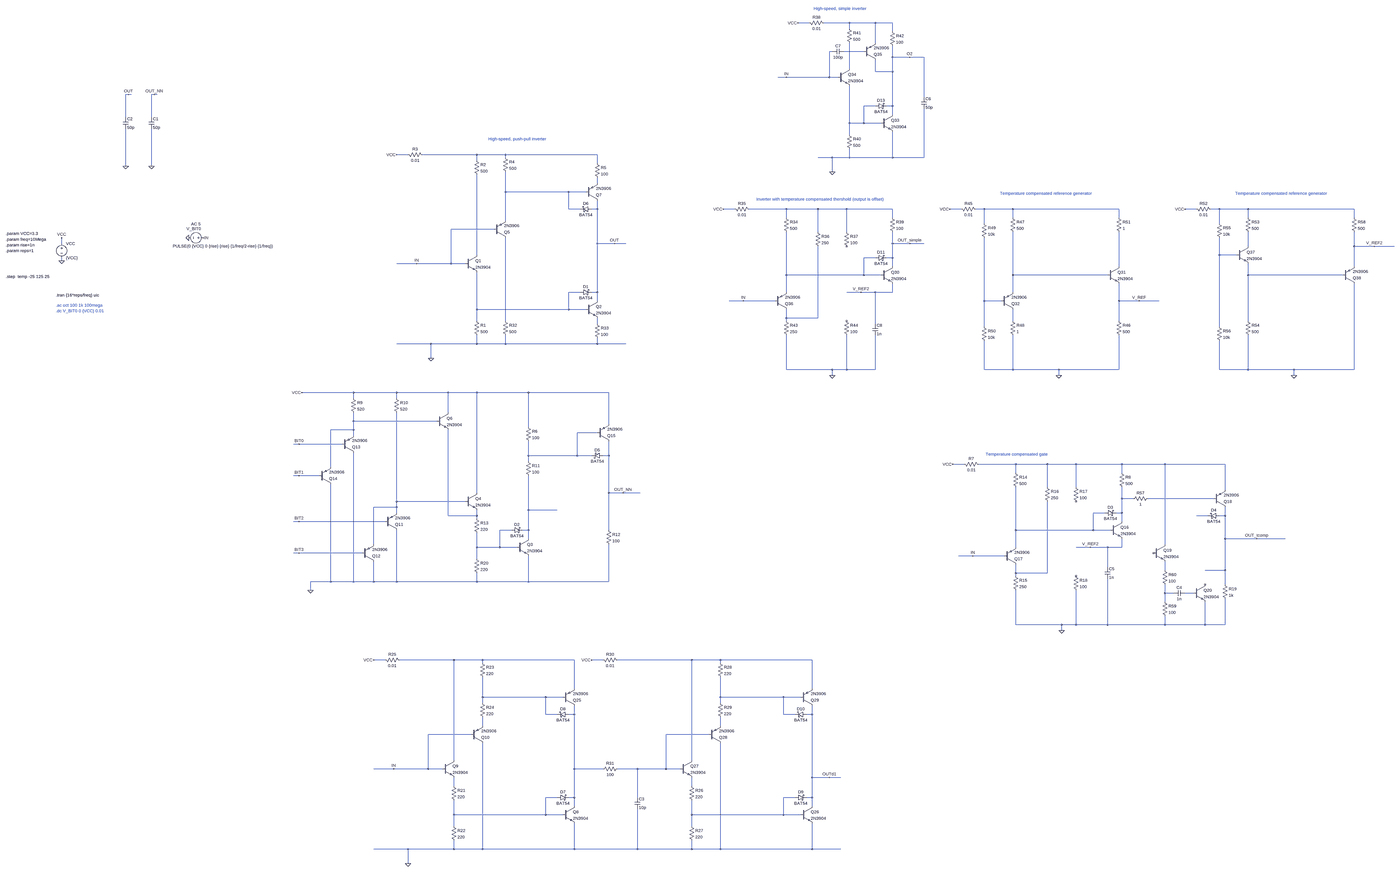
[diagram p0: schematic delay.asc, whole sheet]
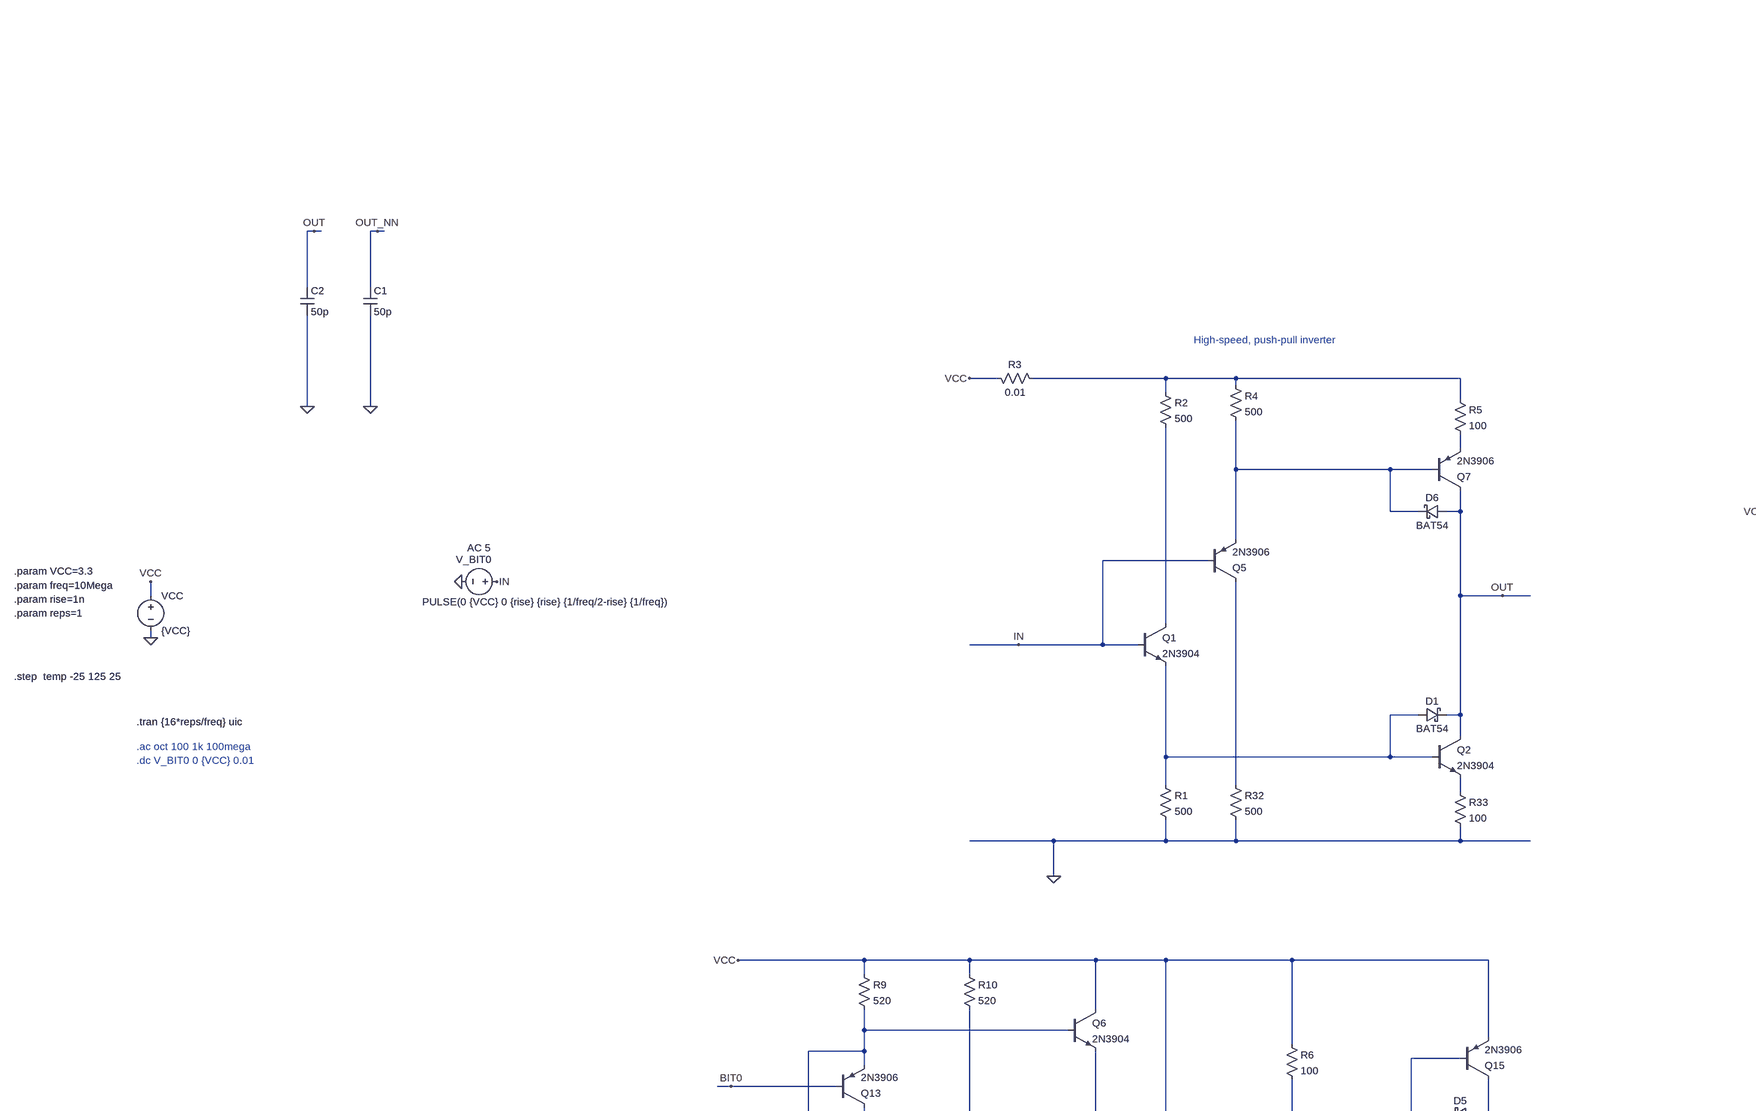
[diagram p1: schematic delay.asc, part, row 1 of 2, column 1 of 2]
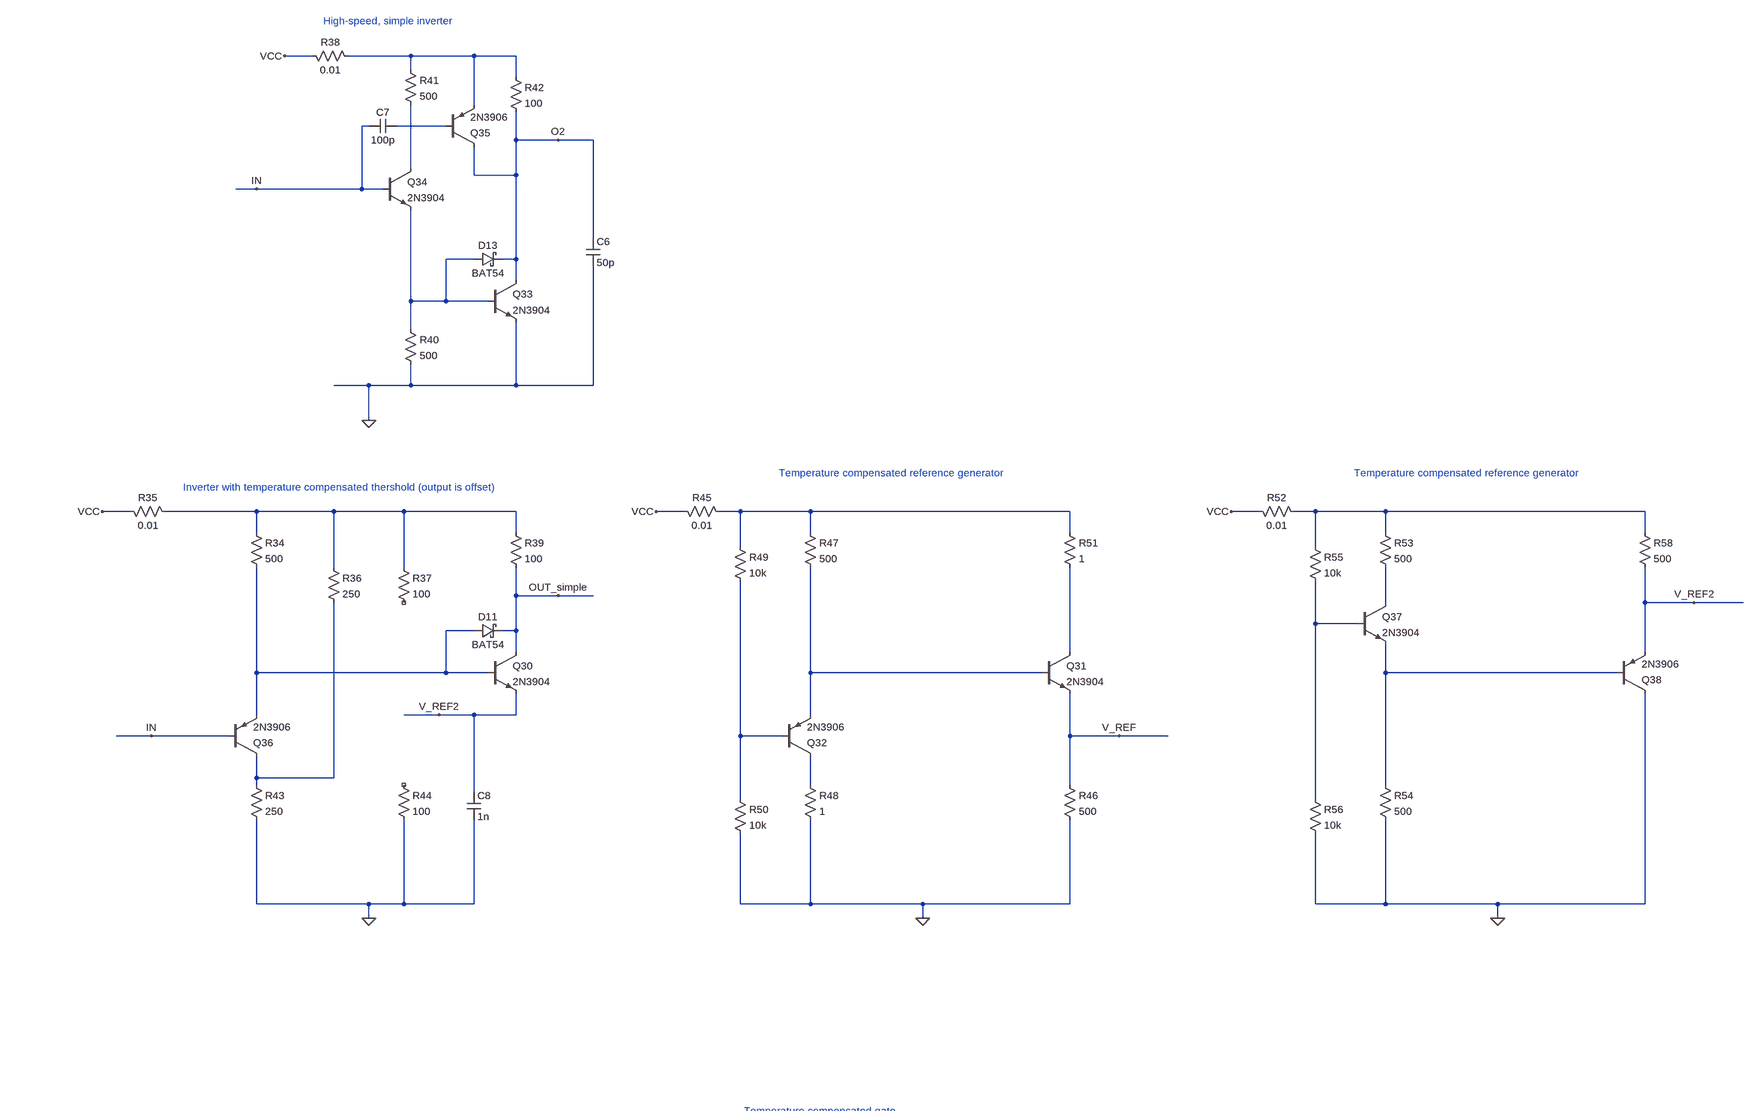
[diagram p2: schematic delay.asc, part, row 1 of 2, column 2 of 2]
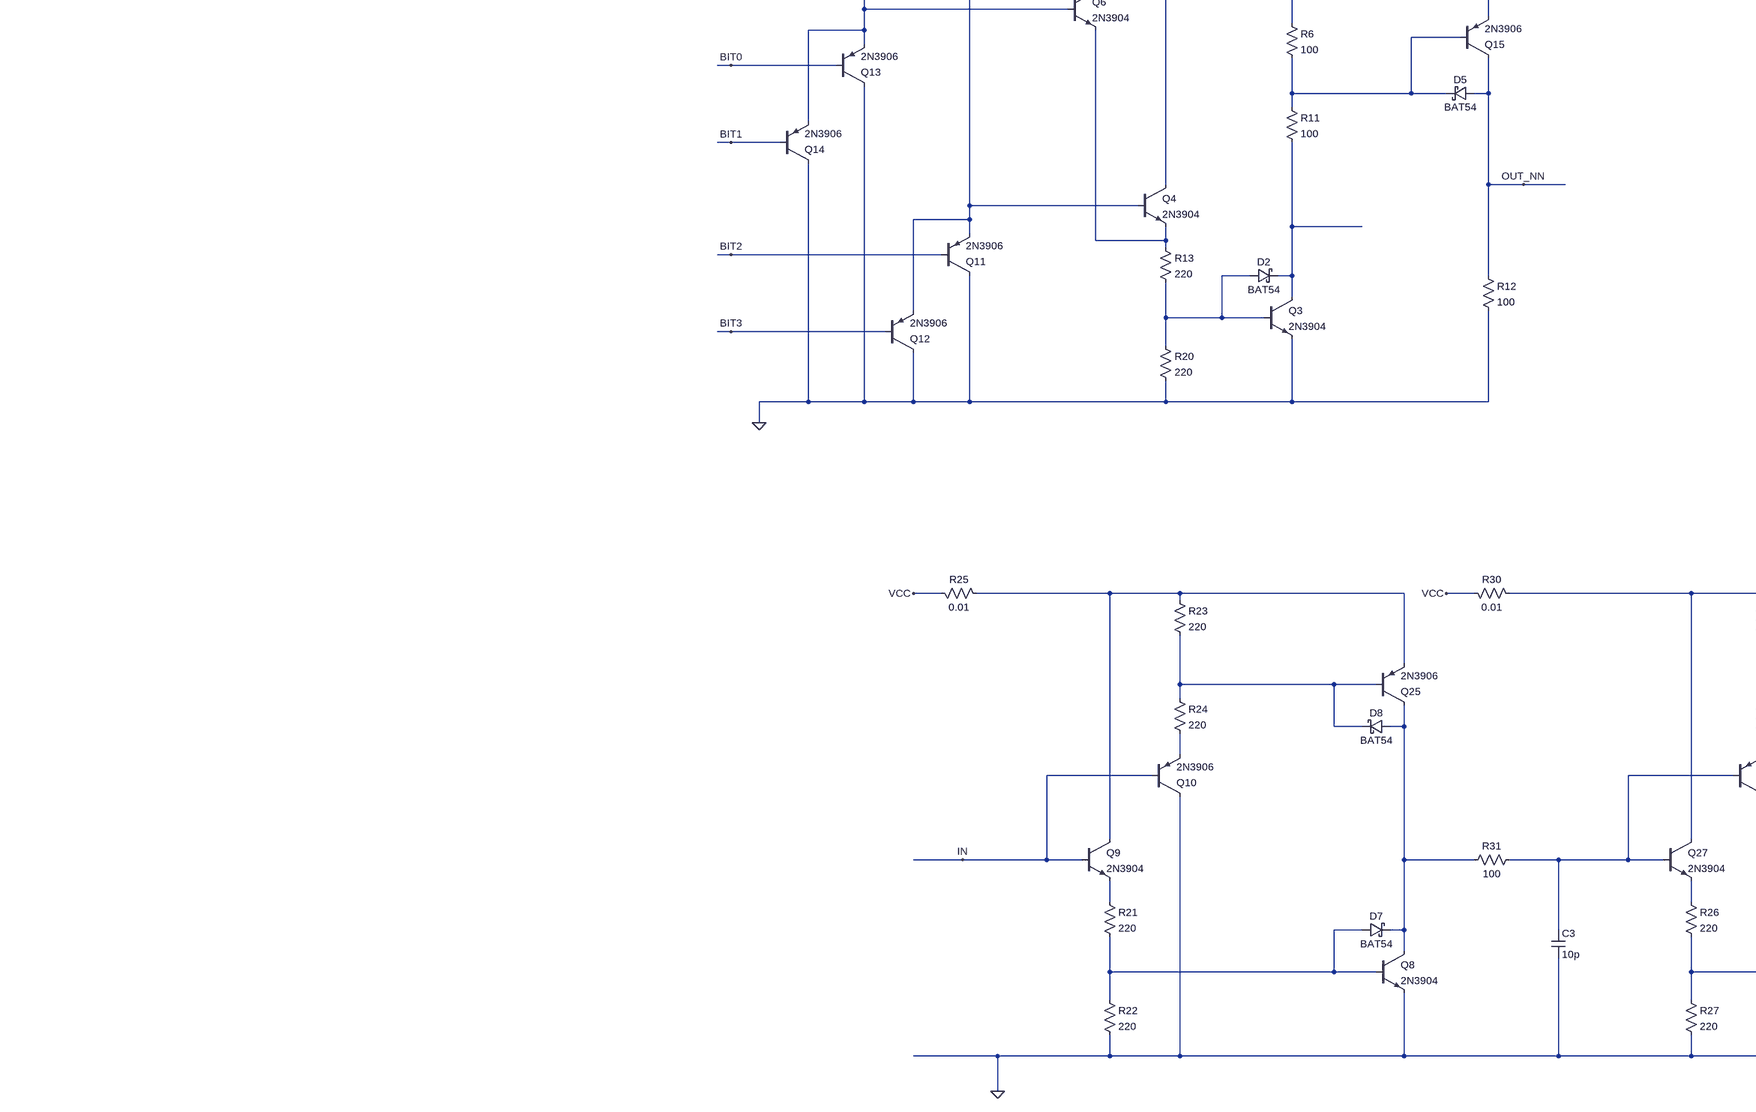
[diagram p3: schematic delay.asc, part, row 2 of 2, column 1 of 2]
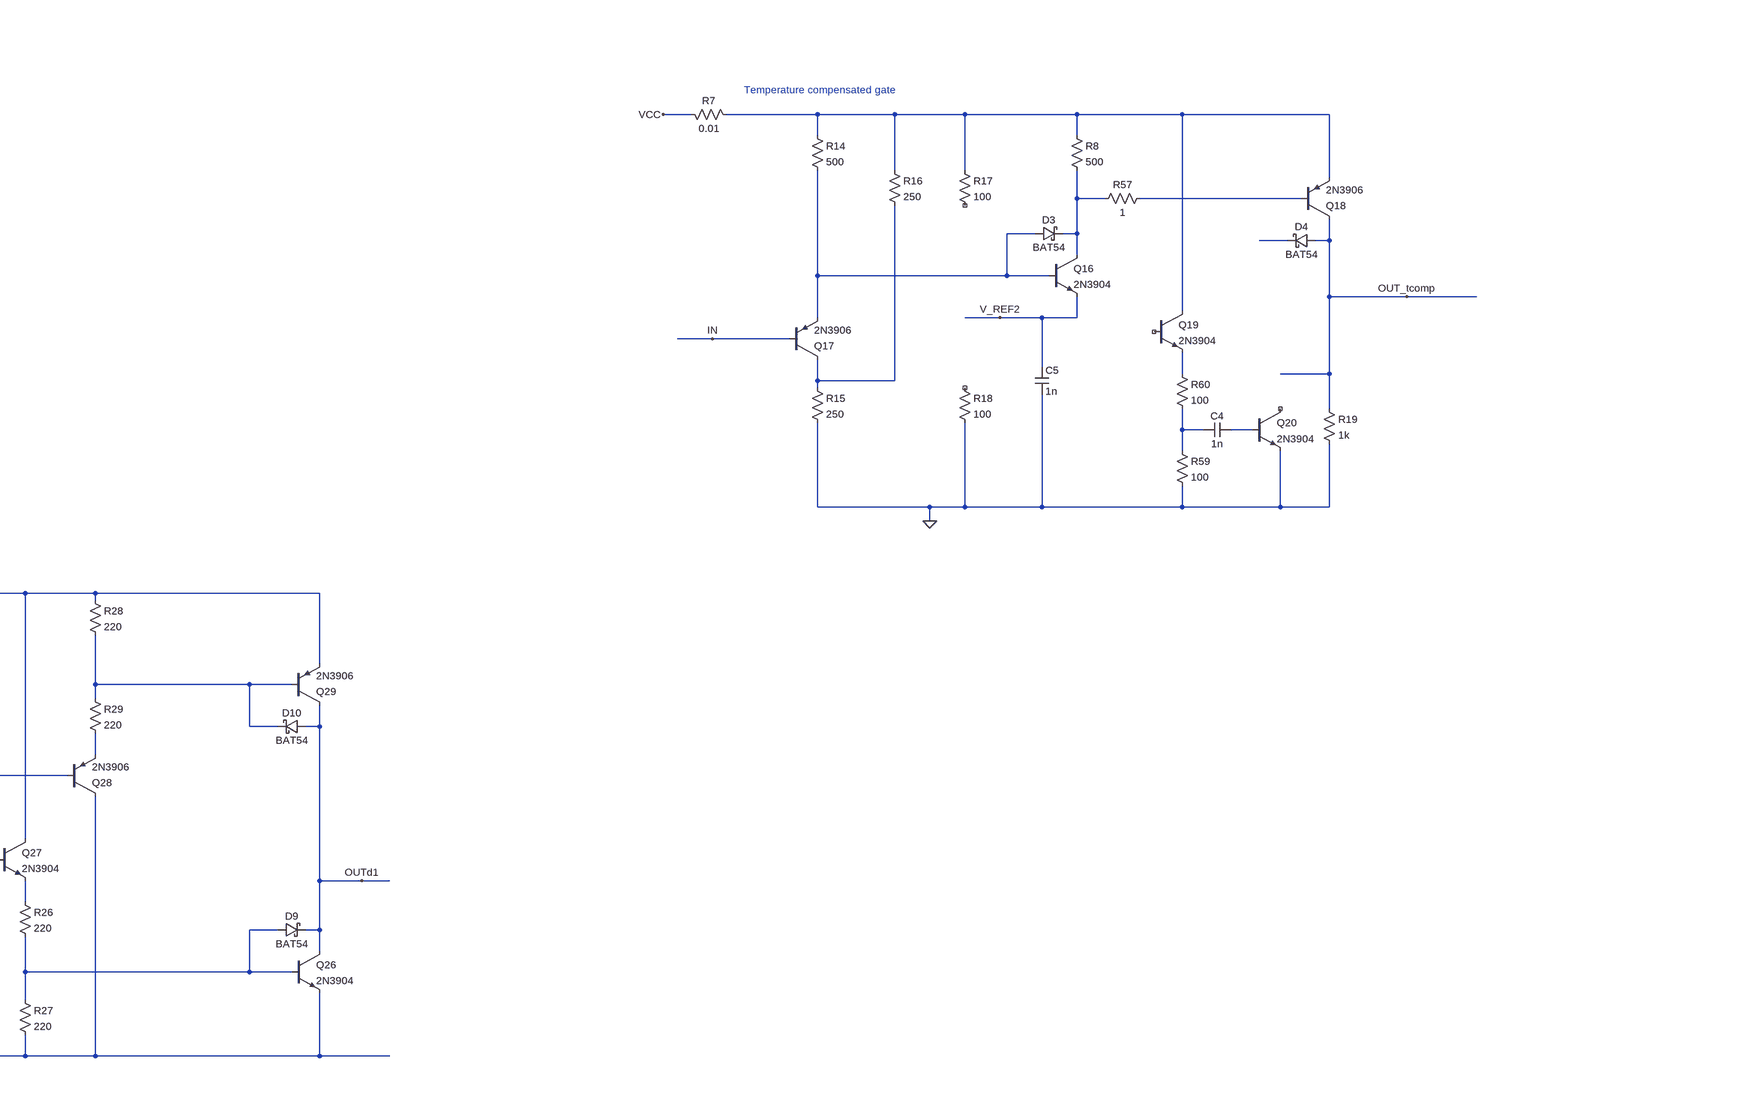
[diagram p4: schematic delay.asc, part, row 2 of 2, column 2 of 2]
delay.asc, the LTspice schematic file:
Version 4.1
SHEET 1 14868 10612
WIRE 4816 -320 4752 -320
WIRE 5040 -320 4896 -320
WIRE 5184 -320 5040 -320
WIRE 5280 -320 5184 -320
WIRE 5040 -288 5040 -320
WIRE 5280 -272 5280 -320
WIRE 5184 -208 5184 -320
WIRE 4944 -160 4928 -160
WIRE 5120 -160 5008 -160
WIRE 5280 -128 5280 -192
WIRE 5376 -128 5280 -128
WIRE 5456 -128 5376 -128
WIRE 5040 -64 5040 -208
WIRE 5184 -48 5184 -112
WIRE 5280 -48 5280 -128
WIRE 5280 -48 5184 -48
WIRE 4688 -16 4640 -16
WIRE 4928 -16 4928 -160
WIRE 4928 -16 4688 -16
WIRE 4976 -16 4928 -16
WIRE -288 80 -304 80
WIRE -272 80 -288 80
WIRE -144 80 -160 80
WIRE -128 80 -144 80
WIRE 5456 96 5456 -128
WIRE 5184 144 5120 144
WIRE 5280 144 5280 -48
WIRE 5280 144 5248 144
WIRE 5280 192 5280 144
WIRE -304 208 -304 80
WIRE -160 208 -160 80
WIRE 5040 240 5040 32
WIRE 5120 240 5120 144
WIRE 5120 240 5040 240
WIRE 5216 240 5120 240
WIRE 5040 304 5040 240
WIRE 2512 416 2448 416
WIRE 2896 416 2592 416
WIRE 3056 416 2896 416
WIRE 3568 416 3056 416
WIRE 3056 432 3056 416
WIRE 4944 432 4864 432
WIRE 5040 432 5040 384
WIRE 5040 432 4944 432
WIRE 5280 432 5280 288
WIRE 5280 432 5040 432
WIRE 5456 432 5456 160
WIRE 5456 432 5280 432
WIRE 2896 448 2896 416
WIRE 3568 464 3568 416
WIRE -304 480 -304 272
WIRE -160 480 -160 272
WIRE 4944 512 4944 432
WIRE 3568 576 3568 544
WIRE 3056 624 3056 512
WIRE 3408 624 3056 624
WIRE 3504 624 3408 624
WIRE 3408 720 3408 624
WIRE 3472 720 3408 720
WIRE 3568 720 3568 672
WIRE 3568 720 3536 720
WIRE 4400 720 4336 720
WIRE 4688 720 4480 720
WIRE 4864 720 4688 720
WIRE 5024 720 4864 720
WIRE 5280 720 5024 720
WIRE 5664 720 5600 720
WIRE 5792 720 5744 720
WIRE 5952 720 5792 720
WIRE 6544 720 5952 720
WIRE 6976 720 6912 720
WIRE 7104 720 7056 720
WIRE 7264 720 7104 720
WIRE 7856 720 7264 720
WIRE 4688 768 4688 720
WIRE 5280 768 5280 720
WIRE 5952 768 5952 720
WIRE 6544 768 6544 720
WIRE 7264 768 7264 720
WIRE 7856 768 7856 720
WIRE 3056 784 3056 624
WIRE 5792 800 5792 720
WIRE 7104 800 7104 720
WIRE 2992 832 2752 832
WIRE 4864 848 4864 720
WIRE 5024 848 5024 720
WIRE -752 912 -752 880
WIRE 3568 912 3568 720
WIRE 3664 912 3568 912
WIRE 3728 912 3664 912
WIRE 5280 912 5280 848
WIRE 5376 912 5280 912
WIRE 5456 912 5376 912
WIRE 7264 928 7264 848
WIRE 7856 928 7856 848
WIRE 7968 928 7856 928
WIRE 8080 928 7968 928
WIRE 2896 976 2896 528
WIRE 7104 976 7104 880
WIRE 7200 976 7104 976
WIRE 5184 992 5120 992
WIRE 5280 992 5280 912
WIRE 5280 992 5248 992
WIRE -752 1008 -752 992
WIRE 2560 1024 2448 1024
WIRE 2752 1024 2752 832
WIRE 2752 1024 2560 1024
WIRE 2832 1024 2752 1024
WIRE 5280 1040 5280 992
WIRE 6544 1040 6544 848
WIRE 7856 1040 7856 928
WIRE 4688 1088 4688 848
WIRE 5120 1088 5120 992
WIRE 5120 1088 4688 1088
WIRE 5216 1088 5120 1088
WIRE 5952 1088 5952 848
WIRE 6480 1088 5952 1088
WIRE 7264 1088 7264 1024
WIRE 7792 1088 7264 1088
WIRE 3472 1184 3408 1184
WIRE 3568 1184 3568 912
WIRE 3568 1184 3536 1184
WIRE 4688 1184 4688 1088
WIRE 5104 1184 5024 1184
WIRE 5184 1184 5104 1184
WIRE 5280 1184 5280 1136
WIRE 5280 1184 5184 1184
WIRE 5952 1184 5952 1088
WIRE 3568 1232 3568 1184
WIRE 4448 1232 4368 1232
WIRE 4624 1232 4448 1232
WIRE 5792 1232 5792 880
WIRE 5888 1232 5792 1232
WIRE 6544 1232 6544 1136
WIRE 6656 1232 6544 1232
WIRE 6768 1232 6656 1232
WIRE 2896 1280 2896 1072
WIRE 3408 1280 3408 1184
WIRE 3408 1280 2896 1280
WIRE 3504 1280 3408 1280
WIRE 4688 1328 4688 1280
WIRE 4864 1328 4864 928
WIRE 4864 1328 4688 1328
WIRE 2896 1344 2896 1280
WIRE 3056 1344 3056 880
WIRE 4688 1344 4688 1328
WIRE 5952 1344 5952 1280
WIRE 6544 1344 6544 1232
WIRE 7264 1344 7264 1088
WIRE 3568 1360 3568 1328
WIRE 5184 1360 5184 1184
WIRE 5792 1376 5792 1232
WIRE 7104 1376 7104 976
WIRE 2640 1472 2448 1472
WIRE 2896 1472 2896 1424
WIRE 2896 1472 2640 1472
WIRE 3056 1472 3056 1424
WIRE 3056 1472 2896 1472
WIRE 3568 1472 3568 1440
WIRE 3568 1472 3056 1472
WIRE 3728 1472 3568 1472
WIRE 2640 1552 2640 1472
WIRE 4688 1616 4688 1424
WIRE 4944 1616 4688 1616
WIRE 5024 1616 5024 1424
WIRE 5024 1616 4944 1616
WIRE 5184 1616 5184 1424
WIRE 5184 1616 5024 1616
WIRE 5792 1616 5792 1456
WIRE 5952 1616 5952 1424
WIRE 5952 1616 5792 1616
WIRE 6208 1616 5952 1616
WIRE 6544 1616 6544 1424
WIRE 6544 1616 6208 1616
WIRE 7104 1616 7104 1456
WIRE 7264 1616 7264 1424
WIRE 7264 1616 7104 1616
WIRE 7520 1616 7264 1616
WIRE 7856 1616 7856 1136
WIRE 7856 1616 7520 1616
WIRE 4944 1648 4944 1616
WIRE 6208 1648 6208 1616
WIRE 7520 1648 7520 1616
WIRE 2208 1744 1920 1744
WIRE 2448 1744 2208 1744
WIRE 2736 1744 2448 1744
WIRE 2896 1744 2736 1744
WIRE 3184 1744 2896 1744
WIRE 3632 1744 3184 1744
WIRE 2208 1776 2208 1744
WIRE 2448 1776 2448 1744
WIRE 2736 1856 2736 1744
WIRE 2208 1904 2208 1856
WIRE 2672 1904 2208 1904
WIRE 3632 1920 3632 1744
WIRE 3184 1936 3184 1744
WIRE 2208 1952 2208 1904
WIRE 2208 1952 2080 1952
WIRE 3568 1968 3456 1968
WIRE 2208 1984 2208 1952
WIRE 1904 2032 1872 2032
WIRE 2144 2032 1904 2032
WIRE 3184 2096 3184 2016
WIRE 3456 2096 3456 1968
WIRE 3456 2096 3184 2096
WIRE 3536 2096 3456 2096
WIRE 3632 2096 3632 2016
WIRE 3632 2096 3600 2096
WIRE 3184 2128 3184 2096
WIRE 5680 2144 5616 2144
WIRE 5968 2144 5760 2144
WIRE 6144 2144 5968 2144
WIRE 6304 2144 6144 2144
WIRE 6560 2144 6304 2144
WIRE 6800 2144 6560 2144
WIRE 7136 2144 6800 2144
WIRE 2080 2160 2080 1952
WIRE 5968 2192 5968 2144
WIRE 6560 2192 6560 2144
WIRE 1904 2208 1872 2208
WIRE 2016 2208 1904 2208
WIRE 6144 2272 6144 2144
WIRE 6304 2272 6304 2144
WIRE 7136 2288 7136 2144
WIRE 2896 2304 2896 1744
WIRE 3632 2304 3632 2096
WIRE 3712 2304 3632 2304
WIRE 3808 2304 3712 2304
WIRE 6560 2336 6560 2272
WIRE 6624 2336 6560 2336
WIRE 7072 2336 6704 2336
WIRE 2448 2352 2448 1856
WIRE 2832 2352 2448 2352
WIRE 2448 2384 2448 2352
WIRE 2448 2384 2320 2384
WIRE 3184 2400 3184 2208
WIRE 3344 2400 3184 2400
WIRE 2448 2416 2448 2384
WIRE 6464 2416 6400 2416
WIRE 6560 2416 6560 2336
WIRE 6560 2416 6528 2416
WIRE 2736 2432 2736 1952
WIRE 2896 2432 2896 2400
WIRE 2896 2432 2736 2432
WIRE 7040 2432 6976 2432
WIRE 7136 2432 7136 2384
WIRE 7136 2432 7104 2432
WIRE 2896 2448 2896 2432
WIRE 1904 2464 1872 2464
WIRE 2384 2464 1904 2464
WIRE 6560 2464 6560 2416
WIRE 3088 2512 3024 2512
WIRE 3184 2512 3184 2400
WIRE 3184 2512 3152 2512
WIRE 3632 2512 3632 2304
WIRE 5968 2512 5968 2272
WIRE 6400 2512 6400 2416
WIRE 6400 2512 5968 2512
WIRE 6496 2512 6400 2512
WIRE 3184 2560 3184 2512
WIRE 7136 2560 7136 2432
WIRE 7312 2560 7136 2560
WIRE 7472 2560 7312 2560
WIRE 2320 2592 2320 2384
WIRE 6800 2592 6800 2144
WIRE 2896 2608 2896 2528
WIRE 3024 2608 3024 2512
WIRE 3024 2608 2896 2608
WIRE 3120 2608 3024 2608
WIRE 5968 2608 5968 2512
WIRE 6384 2608 6304 2608
WIRE 6480 2608 6384 2608
WIRE 6560 2608 6560 2560
WIRE 6560 2608 6480 2608
WIRE 1904 2640 1872 2640
WIRE 2256 2640 1904 2640
WIRE 5728 2656 5648 2656
WIRE 5904 2656 5728 2656
WIRE 2896 2672 2896 2608
WIRE 6480 2720 6480 2608
WIRE 6800 2736 6800 2688
WIRE 7136 2736 7136 2560
WIRE 7136 2736 7024 2736
WIRE 5968 2752 5968 2704
WIRE 6144 2752 6144 2352
WIRE 6144 2752 5968 2752
WIRE 5968 2768 5968 2752
WIRE 2080 2800 2080 2256
WIRE 2080 2800 1968 2800
WIRE 2208 2800 2208 2080
WIRE 2208 2800 2080 2800
WIRE 2320 2800 2320 2688
WIRE 2320 2800 2208 2800
WIRE 2448 2800 2448 2512
WIRE 2448 2800 2320 2800
WIRE 2896 2800 2896 2752
WIRE 2896 2800 2448 2800
WIRE 3184 2800 3184 2656
WIRE 3184 2800 2896 2800
WIRE 3632 2800 3632 2592
WIRE 3632 2800 3184 2800
WIRE 7136 2816 7136 2736
WIRE 1968 2848 1968 2800
WIRE 6800 2864 6800 2816
WIRE 6848 2864 6800 2864
WIRE 6960 2864 6912 2864
WIRE 6800 2912 6800 2864
WIRE 5968 3040 5968 2848
WIRE 6224 3040 5968 3040
WIRE 6304 3040 6304 2848
WIRE 6304 3040 6224 3040
WIRE 6480 3040 6480 2784
WIRE 6480 3040 6304 3040
WIRE 6800 3040 6800 2992
WIRE 6800 3040 6480 3040
WIRE 7024 3040 7024 2912
WIRE 7024 3040 6800 3040
WIRE 7136 3040 7136 2896
WIRE 7136 3040 7024 3040
WIRE 6224 3072 6224 3040
WIRE 2384 3456 2320 3456
WIRE 2768 3456 2464 3456
WIRE 2928 3456 2768 3456
WIRE 3440 3456 2928 3456
WIRE 3600 3456 3536 3456
WIRE 4160 3456 3680 3456
WIRE 4320 3456 4160 3456
WIRE 4832 3456 4320 3456
WIRE 2928 3472 2928 3456
WIRE 4320 3472 4320 3456
WIRE 3440 3616 3440 3456
WIRE 4832 3616 4832 3456
WIRE 2928 3664 2928 3552
WIRE 3280 3664 2928 3664
WIRE 3376 3664 3280 3664
WIRE 4320 3664 4320 3552
WIRE 4672 3664 4320 3664
WIRE 4768 3664 4672 3664
WIRE 2928 3696 2928 3664
WIRE 4320 3696 4320 3664
WIRE 3280 3760 3280 3664
WIRE 3344 3760 3280 3760
WIRE 3440 3760 3440 3712
WIRE 3440 3760 3408 3760
WIRE 4672 3760 4672 3664
WIRE 4736 3760 4672 3760
WIRE 4832 3760 4832 3712
WIRE 4832 3760 4800 3760
WIRE 2928 3824 2928 3776
WIRE 4320 3824 4320 3776
WIRE 2864 3872 2624 3872
WIRE 4256 3872 4016 3872
WIRE 2768 4016 2768 3456
WIRE 4160 4016 4160 3456
WIRE 2432 4064 2320 4064
WIRE 2624 4064 2624 3872
WIRE 2624 4064 2432 4064
WIRE 2704 4064 2624 4064
WIRE 3440 4064 3440 3760
WIRE 3600 4064 3440 4064
WIRE 3792 4064 3680 4064
WIRE 4016 4064 4016 3872
WIRE 4016 4064 3792 4064
WIRE 4096 4064 4016 4064
WIRE 4832 4112 4832 3760
WIRE 4928 4112 4832 4112
WIRE 4992 4112 4928 4112
WIRE 2768 4160 2768 4112
WIRE 4160 4160 4160 4112
WIRE 3344 4224 3280 4224
WIRE 3440 4224 3440 4064
WIRE 3440 4224 3408 4224
WIRE 3792 4224 3792 4064
WIRE 4736 4224 4672 4224
WIRE 4832 4224 4832 4112
WIRE 4832 4224 4800 4224
WIRE 3440 4272 3440 4224
WIRE 4832 4272 4832 4224
WIRE 2768 4320 2768 4240
WIRE 3280 4320 3280 4224
WIRE 3280 4320 2768 4320
WIRE 3376 4320 3280 4320
WIRE 4160 4320 4160 4240
WIRE 4672 4320 4672 4224
WIRE 4672 4320 4160 4320
WIRE 4768 4320 4672 4320
WIRE 2768 4384 2768 4320
WIRE 4160 4384 4160 4320
WIRE 2512 4512 2320 4512
WIRE 2768 4512 2768 4464
WIRE 2768 4512 2512 4512
WIRE 2928 4512 2928 3920
WIRE 2928 4512 2768 4512
WIRE 3440 4512 3440 4368
WIRE 3440 4512 2928 4512
WIRE 3792 4512 3792 4288
WIRE 3792 4512 3440 4512
WIRE 4160 4512 4160 4464
WIRE 4160 4512 3792 4512
WIRE 4320 4512 4320 3920
WIRE 4320 4512 4160 4512
WIRE 4832 4512 4832 4368
WIRE 4832 4512 4320 4512
WIRE 4992 4512 4832 4512
WIRE 2512 4592 2512 4512
FLAG -752 1008 0
FLAG 128 880 IN
FLAG -752 880 VCC
FLAG 48 880 0
FLAG 3664 912 OUT
FLAG 2560 1024 IN
FLAG -288 80 OUT
FLAG -304 480 0
FLAG 3712 2304 OUT_NN
FLAG 1920 1744 VCC
FLAG 1904 2464 BIT2
FLAG 1904 2640 BIT3
FLAG 1968 2848 0
FLAG 1904 2032 BIT0
FLAG 1904 2208 BIT1
FLAG -144 80 OUT_NN
FLAG -160 480 0
FLAG 2448 416 VCC
FLAG 2640 1552 0
FLAG 2432 4064 IN
FLAG 2320 3456 VCC
FLAG 2512 4592 0
FLAG 4928 4112 OUTd1
FLAG 3536 3456 VCC
FLAG 5376 912 OUT_simple
FLAG 4448 1232 IN
FLAG 4336 720 VCC
FLAG 4944 1648 0
FLAG 5376 -128 O2
FLAG 4688 -16 IN
FLAG 4752 -320 VCC
FLAG 4944 512 0
FLAG 5600 720 VCC
FLAG 6208 1648 0
FLAG 6656 1232 V_REF
FLAG 6912 720 VCC
FLAG 7520 1648 0
FLAG 7968 928 V_REF2
FLAG 7312 2560 OUT_tcomp
FLAG 5728 2656 IN
FLAG 5616 2144 VCC
FLAG 6224 3072 0
FLAG 6384 2608 V_REF2
FLAG 5104 1184 V_REF2
SYMBOL voltage -752 896 R0
WINDOW 123 0 0 Left 0
WINDOW 39 0 0 Left 0
SYMATTR InstName VCC
SYMATTR Value {VCC}
SYMBOL voltage 144 880 R90
WINDOW 123 -77 30 VRight 2
WINDOW 39 0 0 Left 0
WINDOW 0 -51 28 VRight 2
WINDOW 3 46 -379 VRight 2
SYMATTR Value2 AC 5
SYMATTR InstName V_BIT0
SYMATTR Value PULSE(0 {VCC} 0 {rise} {rise} {1/freq/2-rise} {1/freq})
SYMBOL npn 3504 1232 R0
SYMATTR InstName Q2
SYMATTR Value 2N3904
SYMBOL schottky 3472 1200 R270
WINDOW 0 32 32 VTop 2
WINDOW 3 0 32 VBottom 2
SYMATTR InstName D1
SYMATTR Value BAT54
SYMATTR Description Diode
SYMATTR Type diode
SYMBOL npn 2832 976 R0
SYMATTR InstName Q1
SYMATTR Value 2N3904
SYMBOL cap -320 208 R0
SYMATTR InstName C2
SYMATTR Value 50p
SYMBOL npn 3120 2560 R0
SYMATTR InstName Q3
SYMATTR Value 2N3904
SYMBOL schottky 3088 2528 R270
WINDOW 0 32 32 VTop 2
WINDOW 3 0 32 VBottom 2
SYMATTR InstName D2
SYMATTR Value BAT54
SYMATTR Description Diode
SYMATTR Type diode
SYMBOL npn 2832 2304 R0
SYMATTR InstName Q4
SYMATTR Value 2N3904
SYMBOL res 3168 1920 R0
SYMATTR InstName R6
SYMATTR Value 100
SYMBOL npn 2672 1856 R0
SYMATTR InstName Q6
SYMATTR Value 2N3904
SYMBOL pnp 2384 2512 M180
SYMATTR InstName Q11
SYMATTR Value 2N3906
SYMBOL pnp 2256 2688 M180
SYMATTR InstName Q12
SYMATTR Value 2N3906
SYMBOL pnp 2144 2080 M180
SYMATTR InstName Q13
SYMATTR Value 2N3906
SYMBOL pnp 2016 2256 M180
SYMATTR InstName Q14
SYMATTR Value 2N3906
SYMBOL res 2192 1760 R0
SYMATTR InstName R9
SYMATTR Value 520
SYMBOL res 2432 1760 R0
SYMATTR InstName R10
SYMATTR Value 520
SYMBOL cap -176 208 R0
SYMATTR InstName C1
SYMATTR Value 50p
SYMBOL schottky 3600 2080 R90
WINDOW 0 0 32 VBottom 2
WINDOW 3 32 32 VTop 2
SYMATTR InstName D5
SYMATTR Value BAT54
SYMATTR Description Diode
SYMATTR Type diode
SYMBOL pnp 3568 2016 M180
SYMATTR InstName Q15
SYMATTR Value 2N3906
SYMBOL res 3168 2112 R0
SYMATTR InstName R11
SYMATTR Value 100
SYMBOL res 3616 2496 R0
SYMATTR InstName R12
SYMATTR Value 100
SYMBOL res 2880 2432 R0
SYMATTR InstName R13
SYMATTR Value 220
SYMBOL res 2880 2656 R0
SYMATTR InstName R20
SYMATTR Value 220
SYMBOL pnp 2992 880 M180
SYMATTR InstName Q5
SYMATTR Value 2N3906
SYMBOL res 3040 416 R0
SYMATTR InstName R4
SYMATTR Value 500
SYMBOL pnp 3504 672 M180
SYMATTR InstName Q7
SYMATTR Value 2N3906
SYMBOL schottky 3536 736 M270
WINDOW 0 32 32 VTop 2
WINDOW 3 0 32 VBottom 2
SYMATTR InstName D6
SYMATTR Value BAT54
SYMATTR Description Diode
SYMATTR Type diode
SYMBOL res 2496 400 M90
WINDOW 0 0 56 VBottom 2
WINDOW 3 32 56 VTop 2
SYMATTR InstName R3
SYMATTR Value 0.01
SYMBOL npn 3376 4272 R0
SYMATTR InstName Q8
SYMATTR Value 2N3904
SYMBOL schottky 3344 4240 R270
WINDOW 0 32 32 VTop 2
WINDOW 3 0 32 VBottom 2
SYMATTR InstName D7
SYMATTR Value BAT54
SYMATTR Description Diode
SYMATTR Type diode
SYMBOL npn 2704 4016 R0
SYMATTR InstName Q9
SYMATTR Value 2N3904
SYMBOL res 2752 4144 R0
SYMATTR InstName R21
SYMATTR Value 220
SYMBOL res 2752 4368 R0
SYMATTR InstName R22
SYMATTR Value 220
SYMBOL pnp 2864 3920 M180
SYMATTR InstName Q10
SYMATTR Value 2N3906
SYMBOL res 2912 3456 R0
SYMATTR InstName R23
SYMATTR Value 220
SYMBOL res 2912 3680 R0
SYMATTR InstName R24
SYMATTR Value 220
SYMBOL pnp 3376 3712 M180
SYMATTR InstName Q25
SYMATTR Value 2N3906
SYMBOL schottky 3408 3776 M270
WINDOW 0 32 32 VTop 2
WINDOW 3 0 32 VBottom 2
SYMATTR InstName D8
SYMATTR Value BAT54
SYMATTR Description Diode
SYMATTR Type diode
SYMBOL res 2368 3440 M90
WINDOW 0 0 56 VBottom 2
WINDOW 3 32 56 VTop 2
SYMATTR InstName R25
SYMATTR Value 0.01
SYMBOL npn 4768 4272 R0
SYMATTR InstName Q26
SYMATTR Value 2N3904
SYMBOL schottky 4736 4240 R270
WINDOW 0 32 32 VTop 2
WINDOW 3 0 32 VBottom 2
SYMATTR InstName D9
SYMATTR Value BAT54
SYMATTR Description Diode
SYMATTR Type diode
SYMBOL npn 4096 4016 R0
SYMATTR InstName Q27
SYMATTR Value 2N3904
SYMBOL res 4144 4144 R0
SYMATTR InstName R26
SYMATTR Value 220
SYMBOL res 4144 4368 R0
SYMATTR InstName R27
SYMATTR Value 220
SYMBOL pnp 4256 3920 M180
SYMATTR InstName Q28
SYMATTR Value 2N3906
SYMBOL res 4304 3456 R0
SYMATTR InstName R28
SYMATTR Value 220
SYMBOL res 4304 3680 R0
SYMATTR InstName R29
SYMATTR Value 220
SYMBOL pnp 4768 3712 M180
SYMATTR InstName Q29
SYMATTR Value 2N3906
SYMBOL schottky 4800 3776 M270
WINDOW 0 32 32 VTop 2
WINDOW 3 0 32 VBottom 2
SYMATTR InstName D10
SYMATTR Value BAT54
SYMATTR Description Diode
SYMATTR Type diode
SYMBOL res 3584 3440 M90
WINDOW 0 0 56 VBottom 2
WINDOW 3 32 56 VTop 2
SYMATTR InstName R30
SYMATTR Value 0.01
SYMBOL res 3696 4048 R90
WINDOW 0 0 56 VBottom 2
WINDOW 3 32 56 VTop 2
SYMATTR InstName R31
SYMATTR Value 100
SYMBOL cap 3776 4224 R0
SYMATTR InstName C3
SYMATTR Value 10p
SYMBOL res 2880 1328 R0
SYMATTR InstName R1
SYMATTR Value 500
SYMBOL res 2880 432 R0
SYMATTR InstName R2
SYMATTR Value 500
SYMBOL res 3040 1328 R0
SYMATTR InstName R32
SYMATTR Value 500
SYMBOL res 3552 448 R0
SYMATTR InstName R5
SYMATTR Value 100
SYMBOL res 3552 1344 R0
SYMATTR InstName R33
SYMATTR Value 100
SYMBOL npn 5216 1040 R0
SYMATTR InstName Q30
SYMATTR Value 2N3904
SYMBOL schottky 5184 1008 R270
WINDOW 0 32 32 VTop 2
WINDOW 3 0 32 VBottom 2
SYMATTR InstName D11
SYMATTR Value BAT54
SYMATTR Description Diode
SYMATTR Type diode
SYMBOL res 4384 704 M90
WINDOW 0 0 56 VBottom 2
WINDOW 3 32 56 VTop 2
SYMATTR InstName R35
SYMATTR Value 0.01
SYMBOL res 5264 752 R0
SYMATTR InstName R39
SYMATTR Value 100
SYMBOL res 4672 752 R0
SYMATTR InstName R34
SYMATTR Value 500
SYMBOL npn 5216 192 R0
SYMATTR InstName Q33
SYMATTR Value 2N3904
SYMBOL schottky 5184 160 R270
WINDOW 0 32 32 VTop 2
WINDOW 3 0 32 VBottom 2
SYMATTR InstName D13
SYMATTR Value BAT54
SYMATTR Description Diode
SYMATTR Type diode
SYMBOL npn 4976 -64 R0
SYMATTR InstName Q34
SYMATTR Value 2N3904
SYMBOL res 4800 -336 M90
WINDOW 0 0 56 VBottom 2
WINDOW 3 32 56 VTop 2
SYMATTR InstName R38
SYMATTR Value 0.01
SYMBOL res 5024 288 R0
SYMATTR InstName R40
SYMATTR Value 500
SYMBOL res 5024 -304 R0
SYMATTR InstName R41
SYMATTR Value 500
SYMBOL res 5264 -288 R0
SYMATTR InstName R42
SYMATTR Value 100
SYMBOL cap 5440 96 R0
SYMATTR InstName C6
SYMATTR Value 50p
SYMBOL pnp 5120 -112 M180
SYMATTR InstName Q35
SYMATTR Value 2N3906
SYMBOL cap 5008 -176 R90
WINDOW 0 0 32 VBottom 2
WINDOW 3 32 32 VTop 2
SYMATTR InstName C7
SYMATTR Value 100p
SYMBOL pnp 4624 1280 M180
SYMATTR InstName Q36
SYMATTR Value 2N3906
SYMBOL res 4672 1328 R0
SYMATTR InstName R43
SYMATTR Value 250
SYMBOL res 4848 832 R0
SYMATTR InstName R36
SYMATTR Value 250
SYMBOL res 5008 832 R0
SYMATTR InstName R37
SYMATTR Value 100
SYMBOL res 5008 1328 R0
SYMATTR InstName R44
SYMATTR Value 100
SYMBOL npn 6480 1040 R0
SYMATTR InstName Q31
SYMATTR Value 2N3904
SYMBOL res 5648 704 M90
WINDOW 0 0 56 VBottom 2
WINDOW 3 32 56 VTop 2
SYMATTR InstName R45
SYMATTR Value 0.01
SYMBOL res 5936 752 R0
SYMATTR InstName R47
SYMATTR Value 500
SYMBOL pnp 5888 1280 M180
SYMATTR InstName Q32
SYMATTR Value 2N3906
SYMBOL res 5936 1328 R0
SYMATTR InstName R48
SYMATTR Value 1
SYMBOL res 5776 784 R0
SYMATTR InstName R49
SYMATTR Value 10k
SYMBOL res 5776 1360 R0
SYMATTR InstName R50
SYMATTR Value 10k
SYMBOL res 6528 1328 R0
SYMATTR InstName R46
SYMATTR Value 500
SYMBOL res 6528 752 R0
SYMATTR InstName R51
SYMATTR Value 1
SYMBOL npn 7200 928 R0
SYMATTR InstName Q37
SYMATTR Value 2N3904
SYMBOL res 6960 704 M90
WINDOW 0 0 56 VBottom 2
WINDOW 3 32 56 VTop 2
SYMATTR InstName R52
SYMATTR Value 0.01
SYMBOL res 7248 752 R0
SYMATTR InstName R53
SYMATTR Value 500
SYMBOL pnp 7792 1136 M180
SYMATTR InstName Q38
SYMATTR Value 2N3906
SYMBOL res 7248 1328 R0
SYMATTR InstName R54
SYMATTR Value 500
SYMBOL res 7088 784 R0
SYMATTR InstName R55
SYMATTR Value 10k
SYMBOL res 7088 1360 R0
SYMATTR InstName R56
SYMATTR Value 10k
SYMBOL res 7840 752 R0
SYMATTR InstName R58
SYMATTR Value 500
SYMBOL npn 6496 2464 R0
SYMATTR InstName Q16
SYMATTR Value 2N3904
SYMBOL schottky 6464 2432 R270
WINDOW 0 32 32 VTop 2
WINDOW 3 0 32 VBottom 2
SYMATTR InstName D3
SYMATTR Value BAT54
SYMATTR Description Diode
SYMATTR Type diode
SYMBOL res 5664 2128 M90
WINDOW 0 0 56 VBottom 2
WINDOW 3 32 56 VTop 2
SYMATTR InstName R7
SYMATTR Value 0.01
SYMBOL res 6544 2176 R0
SYMATTR InstName R8
SYMATTR Value 500
SYMBOL res 5952 2176 R0
SYMATTR InstName R14
SYMATTR Value 500
SYMBOL pnp 5904 2704 M180
SYMATTR InstName Q17
SYMATTR Value 2N3906
SYMBOL res 5952 2752 R0
SYMATTR InstName R15
SYMATTR Value 250
SYMBOL res 6128 2256 R0
SYMATTR InstName R16
SYMATTR Value 250
SYMBOL res 6288 2256 R0
SYMATTR InstName R17
SYMATTR Value 100
SYMBOL res 6288 2752 R0
SYMATTR InstName R18
SYMATTR Value 100
SYMBOL pnp 7072 2384 M180
SYMATTR InstName Q18
SYMATTR Value 2N3906
SYMBOL schottky 7104 2448 M270
WINDOW 0 32 32 VTop 2
WINDOW 3 0 32 VBottom 2
SYMATTR InstName D4
SYMATTR Value BAT54
SYMATTR Description Diode
SYMATTR Type diode
SYMBOL res 7120 2800 R0
SYMATTR InstName R19
SYMATTR Value 1k
SYMBOL res 6720 2320 R90
WINDOW 0 0 56 VBottom 2
WINDOW 3 32 56 VTop 2
SYMATTR InstName R57
SYMATTR Value 1
SYMBOL cap 6464 2720 R0
SYMATTR InstName C5
SYMATTR Value 1n
SYMBOL cap 5168 1360 R0
SYMATTR InstName C8
SYMATTR Value 1n
SYMBOL npn 6736 2592 R0
SYMATTR InstName Q19
SYMATTR Value 2N3904
SYMBOL res 6784 2896 R0
SYMATTR InstName R59
SYMATTR Value 100
SYMBOL res 6784 2720 R0
SYMATTR InstName R60
SYMATTR Value 100
SYMBOL npn 6960 2816 R0
SYMATTR InstName Q20
SYMATTR Value 2N3904
SYMBOL cap 6912 2848 R90
WINDOW 0 0 32 VBottom 2
WINDOW 3 32 32 VTop 2
SYMATTR InstName C4
SYMATTR Value 1n
TEXT -784 1200 Left 2 !.tran {16*reps/freq} uic
TEXT -784 1256 Left 2 ;.ac oct 100 1k 100mega
TEXT -784 1288 Left 2 ;.dc V_BIT0 0 {VCC} 0.01
TEXT -1064 856 Left 2 !.param VCC=3.3
TEXT -1064 888 Left 2 !.param freq=10Mega
TEXT -1064 920 Left 2 !.param rise=1n
TEXT -1064 952 Left 2 !.param reps=1
TEXT -1064 1096 Left 2 !.step  temp -25 125 25
TEXT 2960 328 Left 2 ;High-speed, push-pull inverter
TEXT 4520 664 Left 2 ;Inverter with temperature compensated thershold (output is offset)
TEXT 4840 -400 Left 2 ;High-speed, simple inverter
TEXT 5880 632 Left 2 ;Temperature compensated reference generator
TEXT 7192 632 Left 2 ;Temperature compensated reference generator
TEXT 5800 2088 Left 2 ;Temperature compensated gate

The netlist it stands for:
* delay.asc
VCC VCC 0 {VCC}
V_BIT0 IN 0 PULSE(0 {VCC} 0 {rise} {rise} {1/freq/2-rise} {1/freq}) AC 5
Q2 OUT N018 N023 0 2N3904
D1 N018 OUT BAT54
Q1 N012 IN N018 0 2N3904
C2 OUT 0 50p
Q3 N030 N034 0 0 2N3904
D2 N034 N030 BAT54
Q4 VCC N029 N032 0 2N3904
R6 VCC N025 100
Q6 VCC N024 N032 0 2N3904
Q11 0 BIT2 N029 0 2N3906
Q12 0 BIT3 N029 0 2N3906
Q13 0 BIT0 N024 0 2N3906
Q14 0 BIT1 N024 0 2N3906
R9 VCC N024 520
R10 VCC N029 520
C1 OUT_NN 0 50p
D5 OUT_NN N025 BAT54
Q15 OUT_NN N025 VCC 0 2N3906
R11 N025 N030 100
R12 OUT_NN 0 100
R13 N032 N034 220
R20 N034 0 220
Q5 N021 IN N007 0 2N3906
R4 N005 N007 500
Q7 OUT N007 N006 0 2N3906
D6 OUT N007 BAT54
R3 VCC N005 0.01
Q8 N043 N049 0 0 2N3904
D7 N049 N043 BAT54
Q9 N039 IN N047 0 2N3904
R21 N047 N049 220
R22 N049 0 220
Q10 0 IN N044 0 2N3906
R23 N039 N041 220
R24 N041 N044 220
Q25 N043 N041 N039 0 2N3906
D8 N043 N041 BAT54
R25 VCC N039 0.01
Q26 OUTd1 N050 0 0 2N3904
D9 N050 OUTd1 BAT54
Q27 N040 N046 N048 0 2N3904
R26 N048 N050 220
R27 N050 0 220
Q28 0 N046 N045 0 2N3906
R28 N040 N042 220
R29 N042 N045 220
Q29 OUTd1 N042 N040 0 2N3906
D10 OUTd1 N042 BAT54
R30 VCC N040 0.01
R31 N046 N043 100
C3 N046 0 10p
R1 N018 0 500
R2 N005 N012 500
R32 N021 0 500
R5 N005 N006 100
R33 N023 0 100
Q30 OUT_simple N014 V_REF2 0 2N3904
D11 N014 OUT_simple BAT54
R35 VCC N008 0.01
R39 N008 OUT_simple 100
R34 N008 N014 500
Q33 O2 N004 0 0 2N3904
D13 N004 O2 BAT54
Q34 N003 IN N004 0 2N3904
R38 VCC N001 0.01
R40 N004 0 500
R41 N001 N003 500
R42 N001 O2 100
C6 O2 0 50p
Q35 O2 N002 N001 0 2N3906
C7 N002 IN 100p
Q36 N020 IN N014 0 2N3906
R43 N020 0 250
R36 N008 N020 250
R37 N008 NC_01 100
R44 NC_02 0 100
Q31 N015 N016 V_REF 0 2N3904
R45 VCC N009 0.01
R47 N009 N016 500
Q32 N022 N019 N016 0 2N3906
R48 N022 0 1
R49 N009 N019 10k
R50 N019 0 10k
R46 V_REF 0 500
R51 N009 N015 1
Q37 N011 N013 N017 0 2N3904
R52 VCC N010 0.01
R53 N010 N011 500
Q38 0 N017 V_REF2 0 2N3906
R54 N017 0 500
R55 N010 N013 10k
R56 N013 0 10k
R58 N010 V_REF2 500
Q16 N027 N031 V_REF2 0 2N3904
D3 N031 N027 BAT54
R7 VCC N026 0.01
R8 N026 N027 500
R14 N026 N031 500
Q17 N036 IN N031 0 2N3906
R15 N036 0 250
R16 N026 N036 250
R17 N026 NC_03 100
R18 NC_04 0 100
Q18 OUT_tcomp N028 N026 0 2N3906
D4 OUT_tcomp N033 BAT54
R19 OUT_tcomp 0 1k
R57 N028 N027 1
C5 V_REF2 0 1n
C8 V_REF2 0 1n
Q19 N026 NC_05 N035 0 2N3904
R59 N037 0 100
R60 N035 N037 100
Q20 NC_06 N038 0 0 2N3904
C4 N038 N037 1n
.model D D
.lib standard.dio
.model NPN NPN
.model PNP PNP
.lib standard.bjt
.tran {16*reps/freq} uic
* .ac oct 100 1k 100mega
* .dc V_BIT0 0 {VCC} 0.01
.param VCC=3.3
.param freq=10Mega
.param rise=1n
.param reps=1
.step  temp -25 125 25
* High-speed, push-pull inverter
* Inverter with temperature compensated thershold (output is offset)
* High-speed, simple inverter
* Temperature compensated reference generator
* Temperature compensated reference generator
* Temperature compensated gate
.backanno
.end